# Altium schematic sheet FIT_FPGA_E_G-H.SchDoc: FIT_PM12 board
size 420 x 297 mm; CheckedBy: G.Kasprowicz; Author: INR Moscow; CompanyName: WUT ISE; DrawnBy: M.Podgórski; Organization: WUT ISE; Address1: PW ISE; Address2: Nowowiejska 15/19 00-665 Warsaw; Address3: gkasprow@gmail.com; Revision: 2; SheetNumber: -; SheetTotal: -; ModifiedBy: -; CheckedDate: -; Title2: Title 2; DivGrp: WUT ISE; Designer: INR RAS; ModifiedDate: -; ProjectName: Sensor Box
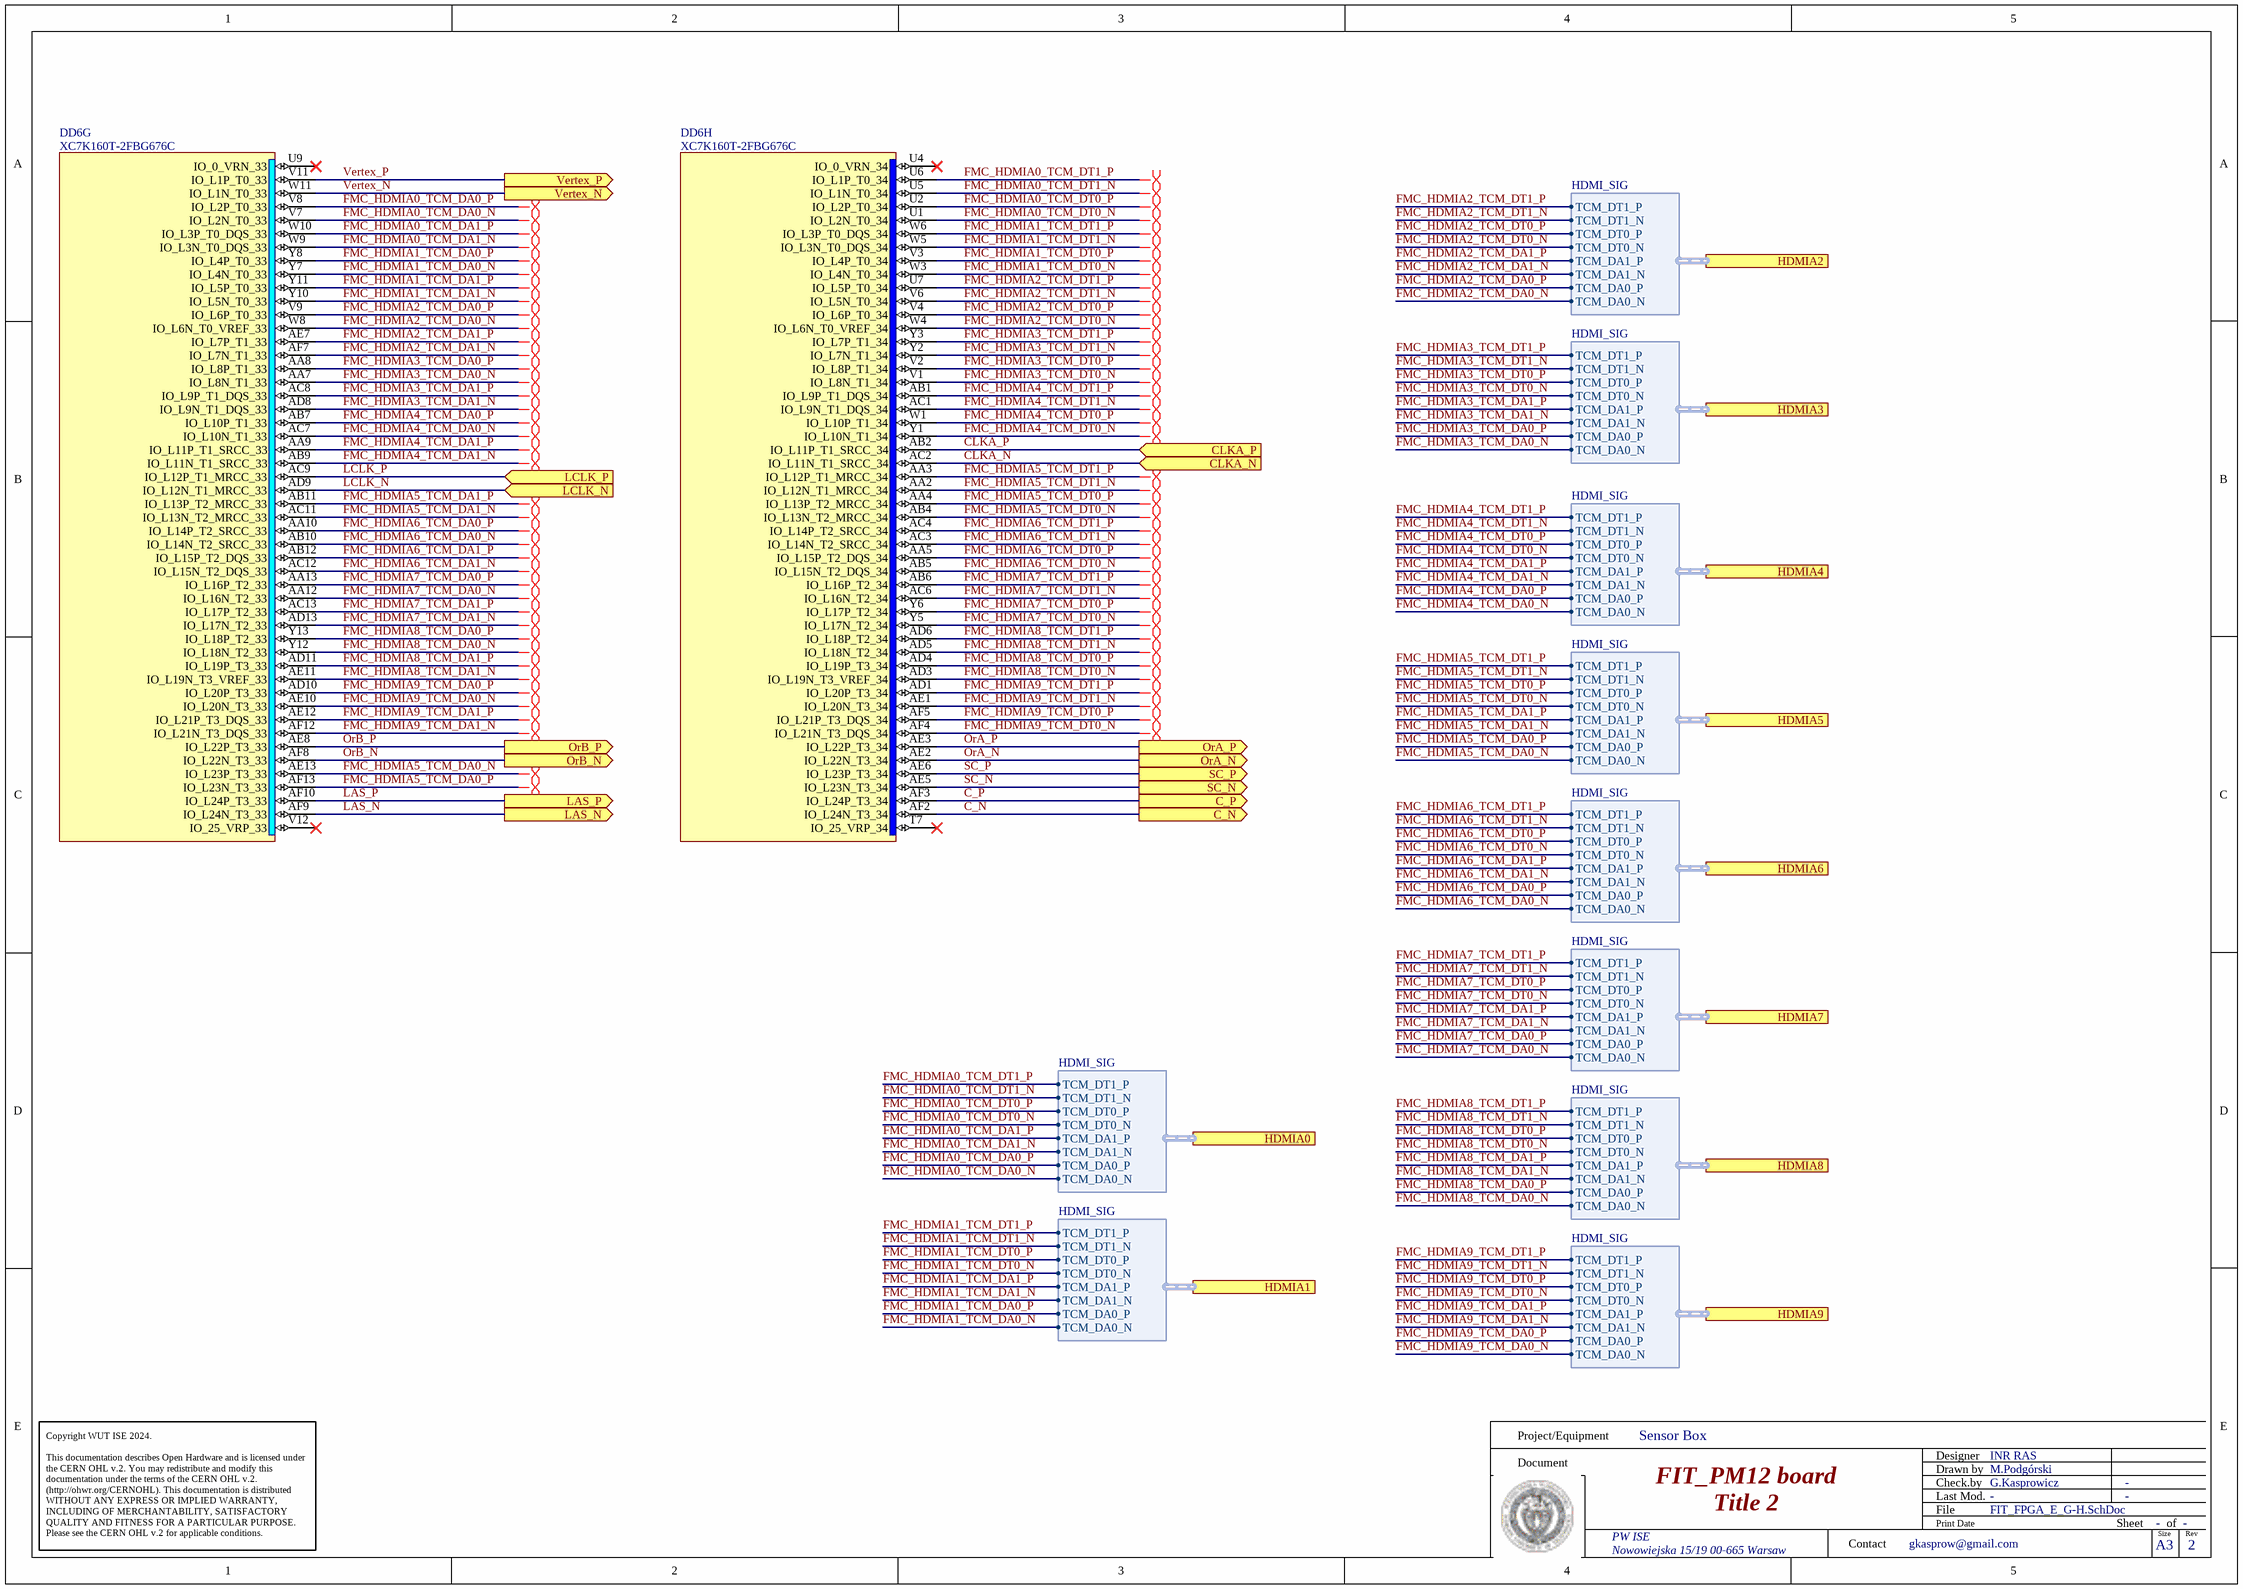
[diagram p0: FIT_FPGA_E_G-H.SchDoc]

## Parts
DD6  XC7K160T-2FBG676C  [BGA676C100P26X26_2700X2700X254]  (parts G,H of 15)

## Ports
C_N (out), C_P (out), CLKA_N (in), CLKA_P (in), HDMIA0 (harness HDMI_SIG), HDMIA1 (harness HDMI_SIG), HDMIA2 (harness HDMI_SIG), HDMIA3 (harness HDMI_SIG), HDMIA4 (harness HDMI_SIG), HDMIA5 (harness HDMI_SIG), HDMIA6 (harness HDMI_SIG), HDMIA7 (harness HDMI_SIG), HDMIA8 (harness HDMI_SIG), HDMIA9 (harness HDMI_SIG), LAS_N (out), LAS_P (out), LCLK_N (in), LCLK_P (in), OrA_N (out), OrA_P (out), OrB_N (out), OrB_P (out), SC_N (out), SC_P (out), Vertex_N (out), Vertex_P (out)

## Harnesses
HDMI_SIG: TCM_DT1_P, TCM_DT1_N, TCM_DT0_P, TCM_DT0_N, TCM_DA1_P, TCM_DA1_N, TCM_DA0_P, TCM_DA0_N

## Nets
C_N: DD6.AF2(IO_L24N_T3_34) ; port C_N
C_P: DD6.AF3(IO_L24P_T3_34) ; port C_P
CLKA_N: DD6.AC2(IO_L11N_T1_SRCC_34) ; port CLKA_N
CLKA_P: DD6.AB2(IO_L11P_T1_SRCC_34) ; port CLKA_P
FMC_HDMIA0_TCM_DA0_N: DD6.V7(IO_L2N_T0_33) ; port HDMIA0.TCM_DA0_N
FMC_HDMIA0_TCM_DA0_P: DD6.V8(IO_L2P_T0_33) ; port HDMIA0.TCM_DA0_P
FMC_HDMIA0_TCM_DA1_N: DD6.W9(IO_L3N_T0_DQS_33) ; port HDMIA0.TCM_DA1_N
FMC_HDMIA0_TCM_DA1_P: DD6.W10(IO_L3P_T0_DQS_33) ; port HDMIA0.TCM_DA1_P
FMC_HDMIA0_TCM_DT0_N: DD6.U1(IO_L2N_T0_34) ; port HDMIA0.TCM_DT0_N
FMC_HDMIA0_TCM_DT0_P: DD6.U2(IO_L2P_T0_34) ; port HDMIA0.TCM_DT0_P
FMC_HDMIA0_TCM_DT1_N: DD6.U5(IO_L1N_T0_34) ; port HDMIA0.TCM_DT1_N
FMC_HDMIA0_TCM_DT1_P: DD6.U6(IO_L1P_T0_34) ; port HDMIA0.TCM_DT1_P
FMC_HDMIA1_TCM_DA0_N: DD6.Y7(IO_L4N_T0_33) ; port HDMIA1.TCM_DA0_N
FMC_HDMIA1_TCM_DA0_P: DD6.Y8(IO_L4P_T0_33) ; port HDMIA1.TCM_DA0_P
FMC_HDMIA1_TCM_DA1_N: DD6.Y10(IO_L5N_T0_33) ; port HDMIA1.TCM_DA1_N
FMC_HDMIA1_TCM_DA1_P: DD6.Y11(IO_L5P_T0_33) ; port HDMIA1.TCM_DA1_P
FMC_HDMIA1_TCM_DT0_N: DD6.W3(IO_L4N_T0_34) ; port HDMIA1.TCM_DT0_N
FMC_HDMIA1_TCM_DT0_P: DD6.V3(IO_L4P_T0_34) ; port HDMIA1.TCM_DT0_P
FMC_HDMIA1_TCM_DT1_N: DD6.W5(IO_L3N_T0_DQS_34) ; port HDMIA1.TCM_DT1_N
FMC_HDMIA1_TCM_DT1_P: DD6.W6(IO_L3P_T0_DQS_34) ; port HDMIA1.TCM_DT1_P
FMC_HDMIA2_TCM_DA0_N: DD6.W8(IO_L6N_T0_VREF_33) ; port HDMIA2.TCM_DA0_N
FMC_HDMIA2_TCM_DA0_P: DD6.V9(IO_L6P_T0_33) ; port HDMIA2.TCM_DA0_P
FMC_HDMIA2_TCM_DA1_N: DD6.AF7(IO_L7N_T1_33) ; port HDMIA2.TCM_DA1_N
FMC_HDMIA2_TCM_DA1_P: DD6.AE7(IO_L7P_T1_33) ; port HDMIA2.TCM_DA1_P
FMC_HDMIA2_TCM_DT0_N: DD6.W4(IO_L6N_T0_VREF_34) ; port HDMIA2.TCM_DT0_N
FMC_HDMIA2_TCM_DT0_P: DD6.V4(IO_L6P_T0_34) ; port HDMIA2.TCM_DT0_P
FMC_HDMIA2_TCM_DT1_N: DD6.V6(IO_L5N_T0_34) ; port HDMIA2.TCM_DT1_N
FMC_HDMIA2_TCM_DT1_P: DD6.U7(IO_L5P_T0_34) ; port HDMIA2.TCM_DT1_P
FMC_HDMIA3_TCM_DA0_N: DD6.AA7(IO_L8N_T1_33) ; port HDMIA3.TCM_DA0_N
FMC_HDMIA3_TCM_DA0_P: DD6.AA8(IO_L8P_T1_33) ; port HDMIA3.TCM_DA0_P
FMC_HDMIA3_TCM_DA1_N: DD6.AD8(IO_L9N_T1_DQS_33) ; port HDMIA3.TCM_DA1_N
FMC_HDMIA3_TCM_DA1_P: DD6.AC8(IO_L9P_T1_DQS_33) ; port HDMIA3.TCM_DA1_P
FMC_HDMIA3_TCM_DT0_N: DD6.V1(IO_L8N_T1_34) ; port HDMIA3.TCM_DT0_N
FMC_HDMIA3_TCM_DT0_P: DD6.V2(IO_L8P_T1_34) ; port HDMIA3.TCM_DT0_P
FMC_HDMIA3_TCM_DT1_N: DD6.Y2(IO_L7N_T1_34) ; port HDMIA3.TCM_DT1_N
FMC_HDMIA3_TCM_DT1_P: DD6.Y3(IO_L7P_T1_34) ; port HDMIA3.TCM_DT1_P
FMC_HDMIA4_TCM_DA0_N: DD6.AC7(IO_L10N_T1_33) ; port HDMIA4.TCM_DA0_N
FMC_HDMIA4_TCM_DA0_P: DD6.AB7(IO_L10P_T1_33) ; port HDMIA4.TCM_DA0_P
FMC_HDMIA4_TCM_DA1_N: DD6.AB9(IO_L11N_T1_SRCC_33) ; port HDMIA4.TCM_DA1_N
FMC_HDMIA4_TCM_DA1_P: DD6.AA9(IO_L11P_T1_SRCC_33) ; port HDMIA4.TCM_DA1_P
FMC_HDMIA4_TCM_DT0_N: DD6.Y1(IO_L10N_T1_34) ; port HDMIA4.TCM_DT0_N
FMC_HDMIA4_TCM_DT0_P: DD6.W1(IO_L10P_T1_34) ; port HDMIA4.TCM_DT0_P
FMC_HDMIA4_TCM_DT1_N: DD6.AC1(IO_L9N_T1_DQS_34) ; port HDMIA4.TCM_DT1_N
FMC_HDMIA4_TCM_DT1_P: DD6.AB1(IO_L9P_T1_DQS_34) ; port HDMIA4.TCM_DT1_P
FMC_HDMIA5_TCM_DA0_N: DD6.AE13(IO_L23P_T3_33) ; port HDMIA5.TCM_DA0_N
FMC_HDMIA5_TCM_DA0_P: DD6.AF13(IO_L23N_T3_33) ; port HDMIA5.TCM_DA0_P
FMC_HDMIA5_TCM_DA1_N: DD6.AC11(IO_L13N_T2_MRCC_33) ; port HDMIA5.TCM_DA1_N
FMC_HDMIA5_TCM_DA1_P: DD6.AB11(IO_L13P_T2_MRCC_33) ; port HDMIA5.TCM_DA1_P
FMC_HDMIA5_TCM_DT0_N: DD6.AB4(IO_L13N_T2_MRCC_34) ; port HDMIA5.TCM_DT0_N
FMC_HDMIA5_TCM_DT0_P: DD6.AA4(IO_L13P_T2_MRCC_34) ; port HDMIA5.TCM_DT0_P
FMC_HDMIA5_TCM_DT1_N: DD6.AA2(IO_L12N_T1_MRCC_34) ; port HDMIA5.TCM_DT1_N
FMC_HDMIA5_TCM_DT1_P: DD6.AA3(IO_L12P_T1_MRCC_34) ; port HDMIA5.TCM_DT1_P
FMC_HDMIA6_TCM_DA0_N: DD6.AB10(IO_L14N_T2_SRCC_33) ; port HDMIA6.TCM_DA0_N
FMC_HDMIA6_TCM_DA0_P: DD6.AA10(IO_L14P_T2_SRCC_33) ; port HDMIA6.TCM_DA0_P
FMC_HDMIA6_TCM_DA1_N: DD6.AC12(IO_L15N_T2_DQS_33) ; port HDMIA6.TCM_DA1_N
FMC_HDMIA6_TCM_DA1_P: DD6.AB12(IO_L15P_T2_DQS_33) ; port HDMIA6.TCM_DA1_P
FMC_HDMIA6_TCM_DT0_N: DD6.AB5(IO_L15N_T2_DQS_34) ; port HDMIA6.TCM_DT0_N
FMC_HDMIA6_TCM_DT0_P: DD6.AA5(IO_L15P_T2_DQS_34) ; port HDMIA6.TCM_DT0_P
FMC_HDMIA6_TCM_DT1_N: DD6.AC3(IO_L14N_T2_SRCC_34) ; port HDMIA6.TCM_DT1_N
FMC_HDMIA6_TCM_DT1_P: DD6.AC4(IO_L14P_T2_SRCC_34) ; port HDMIA6.TCM_DT1_P
FMC_HDMIA7_TCM_DA0_N: DD6.AA12(IO_L16N_T2_33) ; port HDMIA7.TCM_DA0_N
FMC_HDMIA7_TCM_DA0_P: DD6.AA13(IO_L16P_T2_33) ; port HDMIA7.TCM_DA0_P
FMC_HDMIA7_TCM_DA1_N: DD6.AD13(IO_L17N_T2_33) ; port HDMIA7.TCM_DA1_N
FMC_HDMIA7_TCM_DA1_P: DD6.AC13(IO_L17P_T2_33) ; port HDMIA7.TCM_DA1_P
FMC_HDMIA7_TCM_DT0_N: DD6.Y5(IO_L17N_T2_34) ; port HDMIA7.TCM_DT0_N
FMC_HDMIA7_TCM_DT0_P: DD6.Y6(IO_L17P_T2_34) ; port HDMIA7.TCM_DT0_P
FMC_HDMIA7_TCM_DT1_N: DD6.AC6(IO_L16N_T2_34) ; port HDMIA7.TCM_DT1_N
FMC_HDMIA7_TCM_DT1_P: DD6.AB6(IO_L16P_T2_34) ; port HDMIA7.TCM_DT1_P
FMC_HDMIA8_TCM_DA0_N: DD6.Y12(IO_L18N_T2_33) ; port HDMIA8.TCM_DA0_N
FMC_HDMIA8_TCM_DA0_P: DD6.Y13(IO_L18P_T2_33) ; port HDMIA8.TCM_DA0_P
FMC_HDMIA8_TCM_DA1_N: DD6.AE11(IO_L19N_T3_VREF_33) ; port HDMIA8.TCM_DA1_N
FMC_HDMIA8_TCM_DA1_P: DD6.AD11(IO_L19P_T3_33) ; port HDMIA8.TCM_DA1_P
FMC_HDMIA8_TCM_DT0_N: DD6.AD3(IO_L19N_T3_VREF_34) ; port HDMIA8.TCM_DT0_N
FMC_HDMIA8_TCM_DT0_P: DD6.AD4(IO_L19P_T3_34) ; port HDMIA8.TCM_DT0_P
FMC_HDMIA8_TCM_DT1_N: DD6.AD5(IO_L18N_T2_34) ; port HDMIA8.TCM_DT1_N
FMC_HDMIA8_TCM_DT1_P: DD6.AD6(IO_L18P_T2_34) ; port HDMIA8.TCM_DT1_P
FMC_HDMIA9_TCM_DA0_N: DD6.AE10(IO_L20N_T3_33) ; port HDMIA9.TCM_DA0_N
FMC_HDMIA9_TCM_DA0_P: DD6.AD10(IO_L20P_T3_33) ; port HDMIA9.TCM_DA0_P
FMC_HDMIA9_TCM_DA1_N: DD6.AF12(IO_L21N_T3_DQS_33) ; port HDMIA9.TCM_DA1_N
FMC_HDMIA9_TCM_DA1_P: DD6.AE12(IO_L21P_T3_DQS_33) ; port HDMIA9.TCM_DA1_P
FMC_HDMIA9_TCM_DT0_N: DD6.AF4(IO_L21N_T3_DQS_34) ; port HDMIA9.TCM_DT0_N
FMC_HDMIA9_TCM_DT0_P: DD6.AF5(IO_L21P_T3_DQS_34) ; port HDMIA9.TCM_DT0_P
FMC_HDMIA9_TCM_DT1_N: DD6.AE1(IO_L20N_T3_34) ; port HDMIA9.TCM_DT1_N
FMC_HDMIA9_TCM_DT1_P: DD6.AD1(IO_L20P_T3_34) ; port HDMIA9.TCM_DT1_P
LAS_N: DD6.AF9(IO_L24N_T3_33) ; port LAS_N
LAS_P: DD6.AF10(IO_L24P_T3_33) ; port LAS_P
LCLK_N: DD6.AD9(IO_L12N_T1_MRCC_33) ; port LCLK_N
LCLK_P: DD6.AC9(IO_L12P_T1_MRCC_33) ; port LCLK_P
OrA_N: DD6.AE2(IO_L22N_T3_34) ; port OrA_N
OrA_P: DD6.AE3(IO_L22P_T3_34) ; port OrA_P
OrB_N: DD6.AF8(IO_L22N_T3_33) ; port OrB_N
OrB_P: DD6.AE8(IO_L22P_T3_33) ; port OrB_P
SC_N: DD6.AE5(IO_L23N_T3_34) ; port SC_N
SC_P: DD6.AE6(IO_L23P_T3_34) ; port SC_P
Vertex_N: DD6.W11(IO_L1N_T0_33) ; port Vertex_N
Vertex_P: DD6.V11(IO_L1P_T0_33) ; port Vertex_P

Not connected (* = marked no-connect by the designer): DD6 T7(IO_25_VRP_34)* U4(IO_0_VRN_34)* U9(IO_0_VRN_33)* V12(IO_25_VRP_33)*

## Layout directives
differential pair: FMC_HDMIA0_TCM_DA0_N, FMC_HDMIA0_TCM_DA0_P, FMC_HDMIA0_TCM_DA1_N, FMC_HDMIA0_TCM_DA1_P, FMC_HDMIA0_TCM_DT0_N, FMC_HDMIA0_TCM_DT0_P, FMC_HDMIA0_TCM_DT1_N, FMC_HDMIA0_TCM_DT1_P, FMC_HDMIA1_TCM_DA0_N, FMC_HDMIA1_TCM_DA0_P, FMC_HDMIA1_TCM_DA1_N, FMC_HDMIA1_TCM_DA1_P, FMC_HDMIA1_TCM_DT0_N, FMC_HDMIA1_TCM_DT0_P, FMC_HDMIA1_TCM_DT1_N, FMC_HDMIA1_TCM_DT1_P, FMC_HDMIA2_TCM_DA0_N, FMC_HDMIA2_TCM_DA0_P, FMC_HDMIA2_TCM_DA1_N, FMC_HDMIA2_TCM_DA1_P, FMC_HDMIA2_TCM_DT0_N, FMC_HDMIA2_TCM_DT0_P, FMC_HDMIA2_TCM_DT1_N, FMC_HDMIA2_TCM_DT1_P, FMC_HDMIA3_TCM_DA0_N, FMC_HDMIA3_TCM_DA0_P, FMC_HDMIA3_TCM_DA1_N, FMC_HDMIA3_TCM_DA1_P, FMC_HDMIA3_TCM_DT0_N, FMC_HDMIA3_TCM_DT0_P, FMC_HDMIA3_TCM_DT1_N, FMC_HDMIA3_TCM_DT1_P, FMC_HDMIA4_TCM_DA0_N, FMC_HDMIA4_TCM_DA0_P, FMC_HDMIA4_TCM_DA1_N, FMC_HDMIA4_TCM_DA1_P, FMC_HDMIA4_TCM_DT0_N, FMC_HDMIA4_TCM_DT0_P, FMC_HDMIA4_TCM_DT1_N, FMC_HDMIA4_TCM_DT1_P, FMC_HDMIA5_TCM_DA0_N, FMC_HDMIA5_TCM_DA0_P, FMC_HDMIA5_TCM_DA1_N, FMC_HDMIA5_TCM_DA1_P, FMC_HDMIA5_TCM_DT0_N, FMC_HDMIA5_TCM_DT0_P, FMC_HDMIA5_TCM_DT1_N, FMC_HDMIA5_TCM_DT1_P, FMC_HDMIA6_TCM_DA0_N, FMC_HDMIA6_TCM_DA0_P, FMC_HDMIA6_TCM_DA1_N, FMC_HDMIA6_TCM_DA1_P, FMC_HDMIA6_TCM_DT0_N, FMC_HDMIA6_TCM_DT0_P, FMC_HDMIA6_TCM_DT1_N, FMC_HDMIA6_TCM_DT1_P, FMC_HDMIA7_TCM_DA0_N, FMC_HDMIA7_TCM_DA0_P, FMC_HDMIA7_TCM_DA1_N, FMC_HDMIA7_TCM_DA1_P, FMC_HDMIA7_TCM_DT0_N, FMC_HDMIA7_TCM_DT0_P, FMC_HDMIA7_TCM_DT1_N, FMC_HDMIA7_TCM_DT1_P, FMC_HDMIA8_TCM_DA0_N, FMC_HDMIA8_TCM_DA0_P, FMC_HDMIA8_TCM_DA1_N, FMC_HDMIA8_TCM_DA1_P, FMC_HDMIA8_TCM_DT0_N, FMC_HDMIA8_TCM_DT0_P, FMC_HDMIA8_TCM_DT1_N, FMC_HDMIA8_TCM_DT1_P, FMC_HDMIA9_TCM_DA0_N, FMC_HDMIA9_TCM_DA0_P, FMC_HDMIA9_TCM_DA1_N, FMC_HDMIA9_TCM_DA1_P, FMC_HDMIA9_TCM_DT0_N, FMC_HDMIA9_TCM_DT0_P, FMC_HDMIA9_TCM_DT1_N, FMC_HDMIA9_TCM_DT1_P

## Notes on the sheet
- Project/Equipment
- Document
- Designer
- Drawn by
- Check.by
- Copyright WUT ISE 2024.
  This documentation describes Open Hardware and is licensed under the CERN OHL v.2. You may redistribute and modify this documentation under the terms of the CERN OHL v.2. (http://ohwr.org/CERNOHL). This documentation is distributed WITHOUT ANY EXPRESS OR IMPLIED WARRANTY, INCLUDING OF MERCHANTABILITY, SATISFACTORY QUALITY AND FITNESS FOR A PARTICULAR PURPOSE. Please see the CERN OHL v.2 for applicable conditions.
- Contact
- File
- Last Mod.
- Print Date
- Sheet
- Size
- A3
- of
- Rev

## Library data of the parts
DD6 = XC7K160T-2FBG676C: KINTEX-7, FPGA, 676-Ball BGA, Pb-Free; Part Description: KINTEX-7 FPGA, 162240 Logic Cells, 400 User I/O, 8 GTXs, 676-Ball BGA, Speed Grade 2, Commercial Grade, Pb-Free; Manufacturer: XILINX; PressFit: No; Bonding: No; Part Number: XC7K160T-2FBG676C; Component Kind: Standard; Component Type: Standard; Device: XC7K160T-2FBG676C; PackageDescription: BGA, 1.00mm Pitch, Square; 676 Pin, 26 Columns X 26 Rows, Body 27.0mm X 27.0mm X 2.54mm H, IPC Medium Density; Manufacturer Part Number: XC7K160T-2FBG676C; Pin Count: 676; Case: BGA676; Mounted: Yes; Socket: No; SMD: Yes; Sense: No; ComponentHeight: 2.54mm; HelpURL: \\cern.ch\dfs\Applications\Altium\Datasheets\XC7K160T-xFBG676C.pdf; ComponentLink1URL: \\cern.ch\dfs\Applications\Altium\Datasheets\XC7K160T-xFBG676C_Package-Pinout.pdf; ComponentLink1Description: Package/Pinout; Author: CERN DEM BC; CreateDate: 06.02.2020; LatestRevisionDate: 06.02.2020